# Altium project ESP32_C3_Breakout.PrjPcb
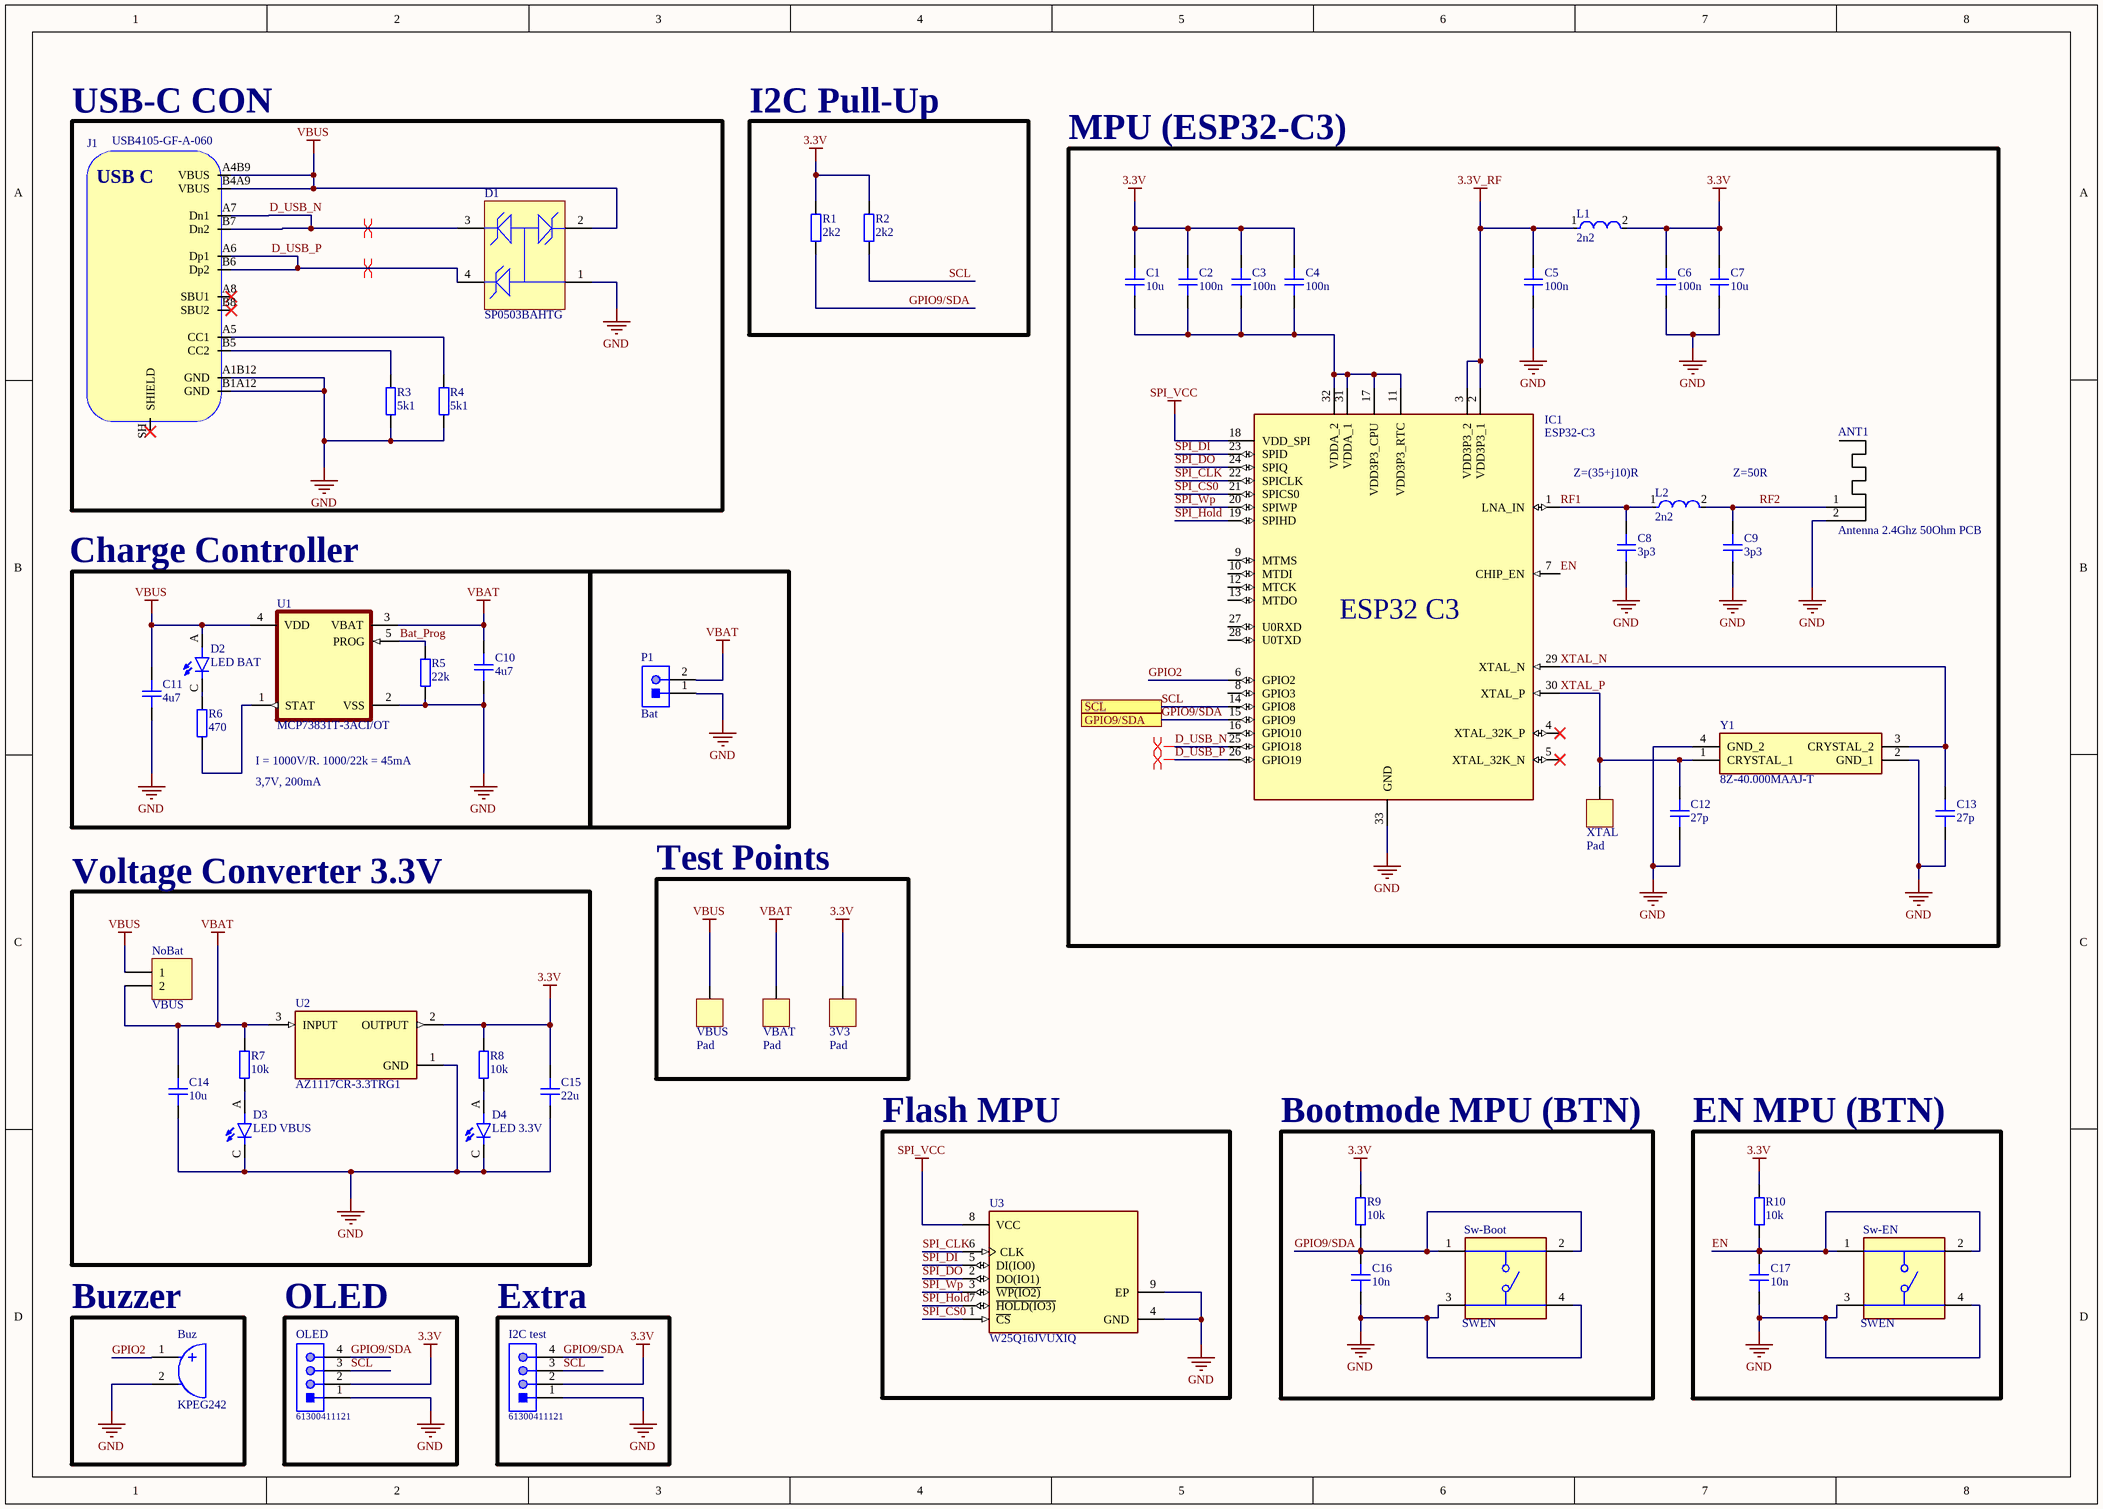
[diagram p0: IC_Schematic.SchDoc]
2 sheets, 77 parts. Net scope: flat (ports and power ports of the same name join across sheets).
Board file: ESP32_C3_Breakout.PcbDoc
Sheets:
  IC_Schematic.SchDoc
  Sensors.SchDoc

## Sheet IC_Schematic.SchDoc
size A3; SheetNumber: 1; SheetTotal: 2

### Parts
3V3  Pad  [PAD_SQ_2MM]
ANT1  Antenna 2.4Ghz 50Ohm PCB  [PCB_Antenna_2.4GHz_50Ohm]
Buz  KPEG242  [KINGS-KPEG242-2]
C1  10u  [CAP_1206]
C2  100n  [CAP_1206]
C3  100n  [CAP_1206]
C4  100n  [CAP_1206]
C5  100n  [CAP_1206]
C6  100n  [CAP_1206]
C7  10u  [CAP_1206]
C8  3p3  [CAP_1206]
C9  3p3  [CAP_1206]
C10  4u7  [CAP_1206]
C11  4u7  [CAP_1206]
C12  27p  [CAP_1206]
C13  27p  [CAP_1206]
C14  10u  [CAP_1206]
C15  22u  [CAP_1206]
C16  10n  [CAP_1206]
C17  10n  [CAP_1206]
D1  SP0503BAHTG  [LFUS-SOT143-4_V]
D2  LED BAT  [LED_1206]
D3  LED VBUS  [LED_1206]
D4  LED 3.3V  [LED_1206]
I2C_test  61300411121  [61300411121]
IC1  ESP32-C3  [QFN50P500X500X90-33N-D]
J1  USB4105-GF-A-060  [USB4105-GF-A-060]
L1  2n2  [FP-LQW18AN_10-MFG]
L2  2n2  [FP-LQW18AN_10-MFG]
NoBat  VBUS  [MHDR1X2]
OLED  61300411121  [61300411121]
P1  Bat  [JST-S2B-PH-K-S_V]
R1  2k2  [RES_1206]
R2  2k2  [RES_1206]
R3  5k1  [RES_1206]
R4  5k1  [RES_1206]
R5  22k  [RES_1206]
R6  470  [RES_1206]
R7  10k  [RES_1206]
R8  10k  [RES_1206]
R9  10k  [RES_1206]
R10  10k  [RES_1206]
Sw-Boot  SWEN  [Switch/Button 4 Pin Through Hole]
Sw-EN  SWEN  [Switch/Button 4 Pin Through Hole]
U1  MCP73831T-3ACI/OT  [SOT95P270X145-5N]
U2  AZ1117CR-3.3TRG1  [FP-SOT89-MFG]
U3  W25Q16JVUXIQ  [FP-UX-MFG]
VBAT  Pad  [PAD_SQ_2MM]
VBUS  Pad  [PAD_SQ_2MM]
XTAL  Pad  [PAD_SQ_2MM]
Y1  8Z-40.000MAAJ-T  [8Z40000MAAJT]

### Blocks framed on the sheet
USB-C CON: D1 J1 R3 R4
I2C Pull-Up: R1 R2
MPU (ESP32-C3): ANT1 C1-C9 C12 C13 IC1 L1 L2 XTAL Y1
Charge Controller: C10 C11 D2 R5 R6 U1
Test Points: 3V3 VBAT VBUS
Voltage Converter 3.3V: C14 C15 D3 D4 NoBat R7 R8 U2
Flash MPU: U3
Bootmode MPU (BTN): C16 R9 Sw-Boot
EN MPU (BTN): C17 R10 Sw-EN
Buzzer: Buz
OLED: OLED
Extra: I2C_test

### Ports
GPIO9/SDA (see Sensors[2D], Sensors[4A], Sensors[5C]), SCL (see Sensors[2C], Sensors[4A], Sensors[5C])

### Nets
3.3V: 3V3.1 C1.2 C2.2 C3.2 C4.2 C6.2 C7.2 C15.2 I2C_test.2 L1.2 OLED.2 R1.1 R2.1 R8.2 R9.1 R10.1 U2.2(OUTPUT)
3.3V_RF: C5.2 IC1.2(VDD3P3_1) IC1.3(VDD3P3_2) L1.1
GND: ANT1.2(GND) Buz.2 C5.1 C6.1 C7.1 C8.1 C9.1 C10.1 C11.1 C12.1 C13.1 C14.1 C15.1 C16.1 C17.1 D1.1 D3.C D4.C I2C_test.1 IC1.33(GND) J1.A1B12(GND) J1.B1A12(GND) OLED.1 P1.1 R3.1 R4.1 R5.1 Sw-Boot.3 Sw-Boot.4 Sw-EN.3 Sw-EN.4 U1.2(VSS) U2.1(GND) U3.4(GND) U3.9(EP) Y1.2(GND_1) Y1.4(GND_2)
SPI_VCC: IC1.18(VDD_SPI) U3.8(VCC)
VBAT: C10.2 C14.2 NoBat.2 P1.2 R7.2 U1.3(VBAT) U2.3(INPUT) VBAT.1
VBUS: C11.2 D1.2 D2.A J1.A4B9(VBUS) J1.B4A9(VBUS) NoBat.1 U1.4(VDD) VBUS.1
Bat_Prog: R5.2 U1.5(PROG)
D_USB_N: D1.3 IC1.25(GPIO18) J1.A7(Dn1) J1.B7(Dn2)
D_USB_P: D1.4 IC1.26(GPIO19) J1.A6(Dp1) J1.B6(Dp2)
EN: C17.2 IC1.7(CHIP_EN) R10.2 Sw-EN.1 Sw-EN.2
GPIO2: Buz.1 IC1.6(GPIO2)
GPIO9/SDA: C16.2 I2C_test.4 IC1.15(GPIO9) OLED.4 R1.2 R9.2 Sw-Boot.1 Sw-Boot.2 ; port GPIO9/SDA
RF1: C8.2 IC1.1(LNA_IN) L2.1
RF2: ANT1.1(RF) C9.2 L2.2
SCL: I2C_test.3 IC1.14(GPIO8) OLED.3 R2.2 ; port SCL
SPI_CLK: IC1.22(SPICLK) U3.6(CLK)
SPI_CS0: IC1.21(SPICS0) U3.1(~{CS})
SPI_DI: IC1.23(SPID) U3.5(DI(IO0))
SPI_DO: IC1.24(SPIQ) U3.2(DO(IO1))
SPI_Hold: IC1.19(SPIHD) U3.7(~{HOLD(IO3)})
SPI_Wp: IC1.20(SPIWP) U3.3(~{WP(IO2)})
XTAL_N: C13.2 IC1.29(XTAL_N) Y1.3(CRYSTAL_2)
XTAL_P: C12.2 IC1.30(XTAL_P) XTAL.1 Y1.1(CRYSTAL_1)
NetC1_1: C1.1 C2.1 C3.1 C4.1 IC1.11(VDD3P3_RTC) IC1.17(VDD3P3_CPU) IC1.31(VDDA_1) IC1.32(VDDA_2)
NetD2_C: D2.C R6.2
NetD3_A: D3.A R7.1
NetD4_A: D4.A R8.1
NetJ1_A5: J1.A5(CC1) R4.2
NetJ1_B5: J1.B5(CC2) R3.2
NetR6_1: R6.1 U1.1(STAT)

Not connected (* = marked no-connect by the designer): IC1 4(XTAL_32K_P)* 5(XTAL_32K_N)* 8(GPIO3) 9(MTMS) 10(MTDI) 12(MTCK) 13(MTDO) 16(GPIO10) 27(U0RXD) 28(U0TXD); J1 A8(SBU1)* B8(SBU2)* SH(SHIELD)*

### Layout directives
differential pair: D_USB_N, D_USB_P

### Notes on the sheet
- Z=(35+j10)R
- Z=50R
- I = 1000V/R. 1000/22k = 45mA
- 3,7V, 200mA
- (in symbol ESP32-C3) ESP32 C3
- (in symbol USB4105-GF-A-060) USB C

### Library data of the parts
3V3 VBAT VBUS XTAL = PAD_SQ_2MM: Test Point Square 2mm
ANT1 = Antenna 2.4Ghz 50Ohm PCB: ESP32 C3
Buz = CMP-2000-06518-1: Piezo Indicator, 4100 Hz, 3 to 16 V, -20 to 70 degC, 2-Pin THD, RoHS; PartNumber: KPE-242; Manufacturer: KingstateElectronicsCorp.; Frequency Range: 3600to4600Hz; Maximum Supply Current: 7mA; Typical Operating Supply Voltage: 12Vdc; Product Height: 7.6mm; Current - Max: 7A; Tone Mode: Continuous; Product Diameter: 13.7mm; Minimum Sound Pressure: 70dBA; Maximum Resonant Frequency: 4600Hz; Type: Indicator; Datasheet URL: https://datasheet.ciiva.com/11776/0900766b8068f3a2-11776713.pdf; Mounting: ThroughHole; Technology: Piezo; Operating Temperature: -20to70°C; Category: AudioIndicatorsandAlerts; Termination Method: Pin; Manufacturer URL: http://www.kingstate.com.tw/index.php/en/; Package Description: 2-Pin Through Hole Device, Body Dia 13.7 mm, Pitch 7.62 mm; Datasheet Version: 01/2006; Package Reference: KPEG242; Mounting Technology: ThroughHole
C1-C17 = CAP_1206_50V: Capacitor SMD 1206 50V
D1 = CMP-2000-05191-1: TVS Diode Array, 30 pF, 30 KV, -40 to 85 degC, 4-Pin SOT143, RoHS, Tape and Reel; Manufacturer: Littelfuse; Direction Type: Uni-Directional; Product Height (mm): 1.05mm; Leakage Current (Max): 0.1uA; Clamping Voltage (Max): 8V; Reverse Stand-off Voltage: 5.5(Min)V; Configuration: Triple; Working Voltage: 5.5V; Product Length (mm): 3.04mm; Working Voltage (Max): 5.5V(Min); Capacitance Value: 30pF; Rad Hardened: No; Number of Elements: 3; Product Depth (mm): 1.4mm; Operating Temperature Max Deg. C: 85C; Suppressor Type: TVS; Operating Temperature Min Deg. C: -40C; Operating Temp Range: -40Cto85C; Mounting: SurfaceMount; Package / Case: SOT-143; Datasheet Version: Dec-13; Package Type: SOT-143; Packaging: TapeandReel; Pin Count: 3+Tab; Operating Temperature Classification: Industrial; Datasheet URL: https://datasheet.ciiva.com/15143/getdatasheetpartid-116020-15143550.pdf; Manufacturer URL: http://www.littelfuse.com/; Leakage Current: 0.1uA; Mounting Style: SurfaceMount; Clamping Voltage: 8V; Polarity: Uni-Directional
D2-D4 = LED - 1206: Yellow 587nm LED Indication - Discrete 2V 1206 _3216 Metric_; MF: Lite-On Inc.; MP: LTST-C230KSKT; Value: *; SnapEDA_Link: https://www.snapeda.com/parts/LTST-C230KSKT/Lite-On%20Inc./view-part/264912/?ref=snap; Availability: Unavailable; Package: 1206 Lite-On; Price: None
I2C_test OLED = CMP-1502-01064-1: THT Vertical Pin Header WR-PHD, Pitch 2.54 mm, Single Row, 4 pins; Manufacturer: Wurth Elektronik; Withstanding Voltage: 500VAC; Rated Current: 3A; Working Voltage: 250VAC; Pin Number: 4; Gender: Male; Contact Resistance: 20mOhm; Pitch: 2.54mm; Manufacturer URL: http://www.we-online.de; Operating Temperature: -40to105degC; Packaging: Bag; Mounting Technology: THT; Package Reference: 61300411121; Datasheet URL: https://katalog.we-online.de/em/datasheet/6130xx11121.pdf; Publisher: WurthElektronik; Part Number: 61300411121; Row Number: Single; Orientation: Vertical
IC1 = ESP32-C3: Integrated Circuit; Manufacturer_Name: Espressif Systems; Datasheet Link: https://www.espressif.com/sites/default/files/documentation/esp32-c3_datasheet_en.pdf; Height: 0.9mm; Manufacturer_Part_Number: ESP32-C3; Mouser Part Number: 356-ESP32-C3; Mouser Price/Stock: https://www.mouser.co.uk/ProductDetail/Espressif-Systems/ESP32-C3?qs=iLbezkQI%252BsiMXe7tMG%252Bo%2FA%3D%3D
J1 = USB4105-GF-A-060: USB Connector Type C SMT 12 Pin; Manufacturer: GCT; Manufacturer Part Number: USB4105-GF-A-060
L1 L2 = CMP-06042-001078-1: Wire Wound RF Inductor for Automotive 2.2nH ±0.5nH 1400mA 0.018Ω 0603 (1608)
NoBat = MHDR1X2: Header, 2-Pin; LatestRevisionDate: 17-Jul-2002; LatestRevisionNote: Re-released for DXP Platform.; Publisher: Altium Limited
P1 = CMP-1755-00004-1: Male Header, Pitch 2 mm, 1 x 2 Position, Height 4.8 mm, Tail Length 3.4 mm, -25 to 85 degC, RoHS, Bulk; Case\Package: Radial; Tolerance: 20%; Capacitance: 10 uF; Voltage Rating (DC): 50 V; Packaging: Bulk; ComponentLink1URL: http://www.jst-mfg.com/product/pdf/eng/ePH.pdf; Radiation Hardening: No; Height: 11 mm; Package Quantity: 200; PackageDescription: Male Header, Pitch 2 mm, 1 x 2 Position, Height 4.8 mm, Tail Length 3.4 mm; PackageReference: S2B-PH-K-S; Diameter: 5 mm; Pins: 2; Mount: Through Hole; Max Operating Temperature: 85 degC; Min Operating Temperature: -40 degC; ComponentLink1Description: Datasheet; DatasheetVersion: Dec-12; Length: 11 mm; Lead Pitch: 2 mm; REACH SVHC: No SVHC; Voltage Rating: 50 V; RoHSCompliant: true
R1-R10 = RES_1206: Resistor SMD 1206
Sw-Boot Sw-EN = Switch/Button 4 Pin Through Hole: TS02-66-120-BK-260-LCR-D / 6 x 6 mm, 12 mm Actuator Height, 260 gf, Black, Long Crimped, Through Hole, SPST, Tactile Switch; MF: CUI Devices; SnapEDA_Link: https://www.snapeda.com/parts/TS02-66-120-BK-260-LCR-D/CUI+Devices/view-part/?ref=snap; Package: None; MP: TS02-66-120-BK-260-LCR-D; CUI_purchase_URL: https://www.cuidevices.com/product/switches/tactile-switches/ts02-series?utm_source=snapeda.com&utm_medium=referral&utm_campaign=snapedaBOM; Value: *; Check_prices: https://www.snapeda.com/parts/TS02-66-120-BK-260-LCR-D/CUI+Devices/view-part/?ref=eda; Price: None; Purchase-URL: https://pricing.snapeda.com/search/part/TS02-66-120-BK-260-LCR-D/?ref=eda; Availability: In Stock
U1 = MCP73831T-3ACI/OT: Charger IC Lithium Ion/Polymer SOT-23-5; MF: Microchip; Package: SOT-23-5 Microchip; MP: MCP73831T-3ACI/OT; SnapEDA_Link: https://www.snapeda.com/parts/MCP73831T-3ACI/OT/Microchip/view-part/1099789/?ref=snap; Mouser-Purchase-URL: https://snapeda.com/shop?store=Mouser&id=1099789; Value: *; Arrow_Electronics-Purchase-URL: https://snapeda.com/shop?store=Arrow+Electronics&id=1099789
U2 = CMP-12756-000007-1: IC REG LINEAR 3.3V 800MA SOT89; Manufacturer: Diodes Inc.; Nominal Supply Current: 4mA; Output Type: Fixed; Accuracy Percentage: 1%; Max Junction Temp: +125°C; Max Supply Voltage: 15V; Number Of Outputs: 1; Output Current: 1.35A; Dropout Voltage: 1.2V; Device Class L1: Integrated Circuits (ICs); ComponentLink2URL: https://www.diodes.com/assets/Datasheets/AZ1117C.pdf; Temperature Range High: +125°C; Octopart: https://octopart.com/az1117cr-3.3trg1-diodes+inc.-30954805; Output Voltage: 3.3V; Automotive: No; RoHS: TRUE; Temperature Range Low: -20°C; Package: SOT89; Height: 1.6mm; Mouser Description: DiodesZetex AZ1117CR-3.3TRG1, LDO Regulator, 800mA, 3.3 V, ±1% 3-Pin, SOT-89; Manufacturer Part Number: AZ1117CR-3.3TRG1; ComponentLink2Description: Datasheet; Device Class L2: Power Management ICs; Lead Free: Yes; Device Class L3: Voltage Regulators - Linear; Category: IC; Temperature: -20°C to +125°C; Footprint Url: https://www.diodes.com/assets/Package-Files/SOT89.pdf; Digikey Description: IC REG LINEAR 3.3V 800MA SOT89
U3 = CMP-78876-000011-1: IC FLASH 16MBIT SPI/QUAD 8USON; RoHS Compliant: Yes
Y1 = 8Z-40.000MAAJ-T: Crystal or Oscillator; Manufacturer_Name: TXC CORPORATION; Datasheet Link: https://www.farnell.com/datasheets/1041872.pdf; Height: 0.55mm; Manufacturer_Part_Number: 8Z-40.000MAAJ-T; Arrow Part Number: 8Z-40.000MAAJ-T; Arrow Price/Stock: https://www.arrow.com/en/products/8z-40.000maaj-t/txc-corporation

## Sheet Sensors.SchDoc
size A3; SheetNumber: 2; SheetTotal: 2
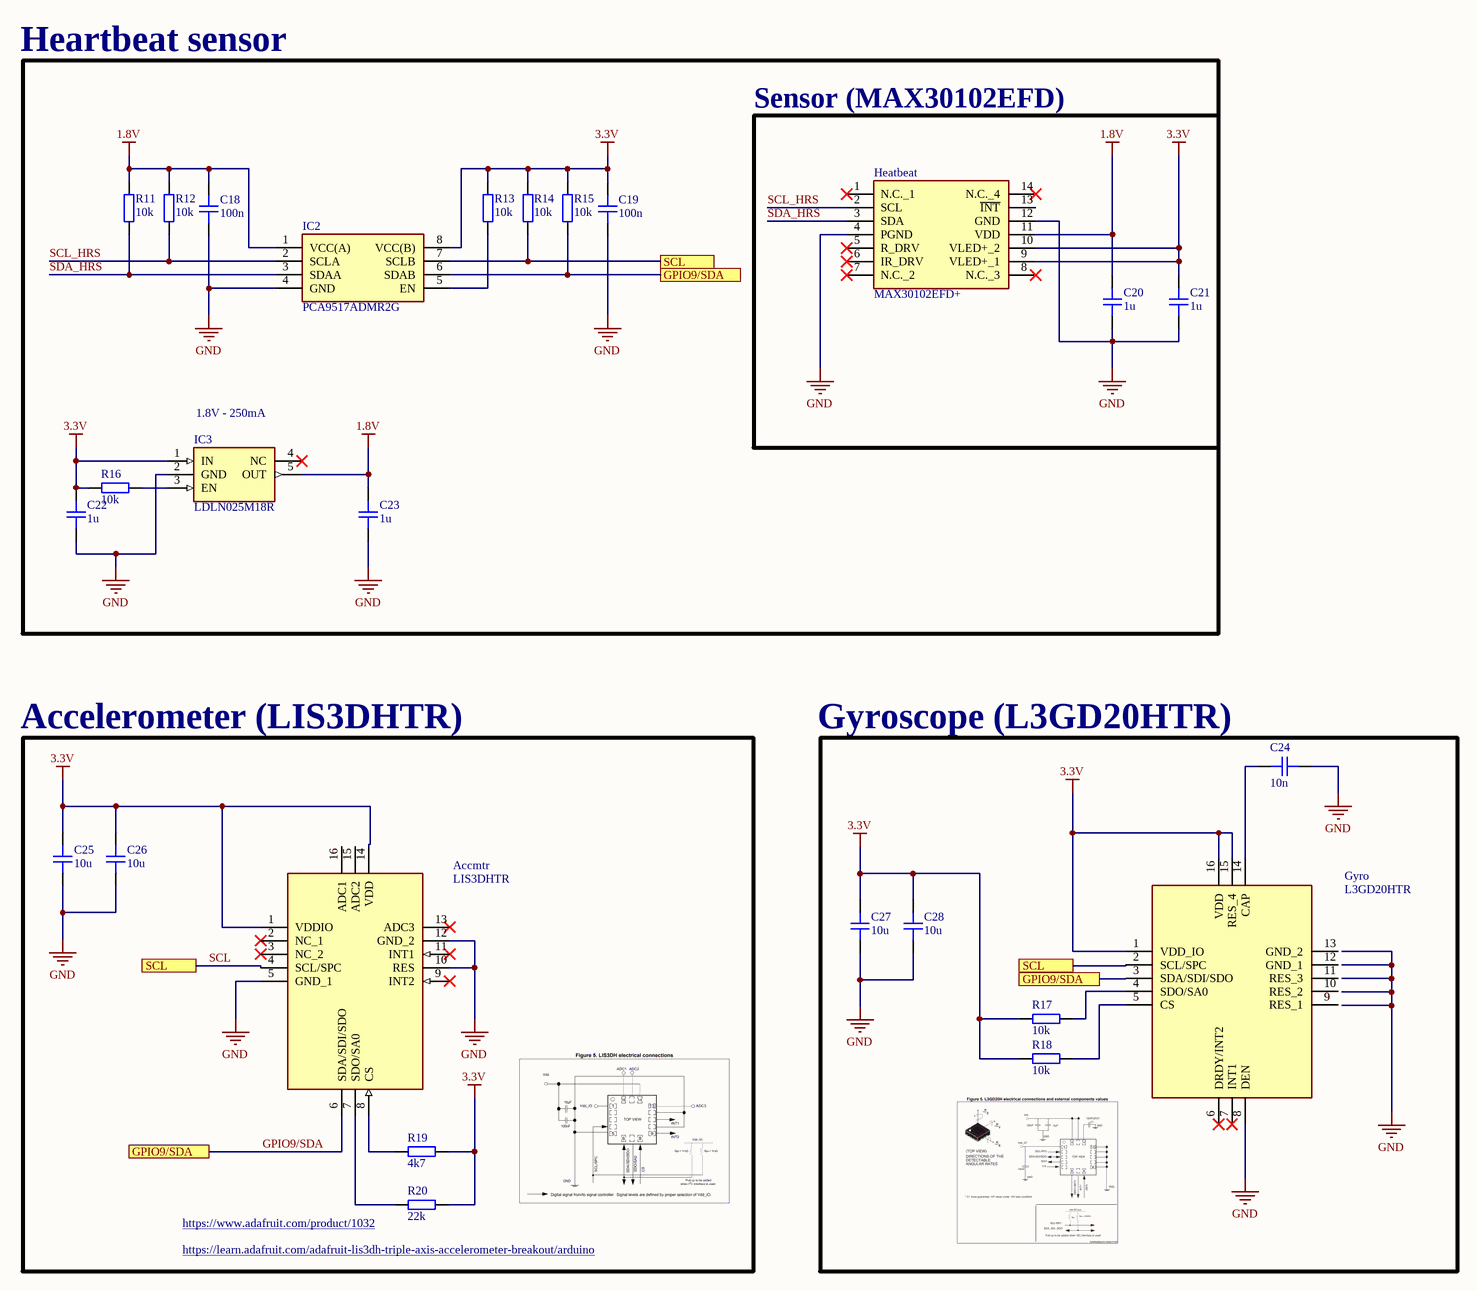
[diagram p1: Sensors.SchDoc]

### Parts
Accmtr  LIS3DHTR  [LIS3DHTR]
C18  100n  [CAP_1206]
C19  100n  [CAP_1206]
C20  1u  [CAP_1206]
C21  1u  [CAP_1206]
C22  1u  [CAP_1206]
C23  1u  [CAP_1206]
C24  10n  [CAP_1206]
C25  10u  [CAP_1206]
C26  10u  [CAP_1206]
C27  10u  [CAP_1206]
C28  10u  [CAP_1206]
Gyro  L3GD20HTR  [H3LIS100DLTR]
Heatbeat  MAX30102EFD+  [14-LEAD-OESIP]
IC2  PCA9517ADMR2G  [SOP65P490X110-8N]
IC3  LDLN025M18R  [SOT95P280X145-5N]
R11  10k  [RES_1206]
R12  10k  [RES_1206]
R13  10k  [RES_1206]
R14  10k  [RES_1206]
R15  10k  [RES_1206]
R16  10k  [RES_1206]
R17  10k  [RES_1206]
R18  10k  [RES_1206]
R19  4k7  [RES_1206]
R20  22k  [RES_1206]

### Blocks framed on the sheet
Heartbeat sensor: C18 C19 C22 C23 IC2 IC3 R11-R16
Sensor (MAX30102EFD): C20 C21 Heatbeat
Accelerometer (LIS3DHTR): Accmtr C25 C26 R19 R20
Gyroscope (L3GD20HTR): C24 C27 C28 Gyro R17 R18

### Ports
GPIO9/SDA (see IC_Schematic[5B], Sensors[2D], Sensors[4A]), GPIO9/SDA (see IC_Schematic[5B], Sensors[2D], Sensors[5C]), GPIO9/SDA (see IC_Schematic[5B], Sensors[4A], Sensors[5C]), SCL (see IC_Schematic[5B], Sensors[2C], Sensors[4A]), SCL (see IC_Schematic[5B], Sensors[2C], Sensors[5C]), SCL (see IC_Schematic[5B], Sensors[4A], Sensors[5C])

### Nets
1.8V: C18.2 C20.2 C23.2 Heatbeat.11(VDD) IC2.1(VCC(A)) IC3.5(OUT) R11.1 R12.1
3.3V: Accmtr.1(VDDIO) Accmtr.14(VDD) C19.2 C21.2 C22.2 C25.2 C26.2 C27.2 C28.2 Gyro.1(VDD_IO) Gyro.15(RES_4) Gyro.16(VDD) Heatbeat.9(VLED+_1) Heatbeat.10(VLED+_2) IC2.8(VCC(B)) IC3.1(IN) R13.1 R14.1 R15.1 R16.1 R17.2 R18.2 R19.1 R20.1
GND: Accmtr.5(GND_1) Accmtr.10(RES) Accmtr.12(GND_2) C18.1 C19.1 C20.1 C21.1 C22.1 C23.1 C24.2 C25.1 C26.1 C27.1 C28.1 Gyro.8(DEN) Heatbeat.4(PGND) Heatbeat.12(GND) IC2.4(GND) IC3.2(GND)
GPIO9/SDA: Accmtr.6(SDA/SDI/SDO) Gyro.3(SDA/SDI/SDO) IC2.6(SDAB) R15.2 ; port GPIO9/SDA
SCL: Accmtr.4(SCL/SPC) Gyro.2(SCL/SPC) IC2.7(SCLB) R14.2 ; port SCL
SCL_HRS: Heatbeat.2(SCL) IC2.2(SCLA) R12.2
SDA_HRS: Heatbeat.3(SDA) IC2.3(SDAA) R11.2
NetAccmtr_7: Accmtr.7(SDO/SA0) R20.2
NetAccmtr_8: Accmtr.8(CS) R19.2
NetC24_1: C24.1 Gyro.14(CAP)
NetGyro_4: Gyro.4(SDO/SA0) R17.1
NetGyro_5: Gyro.5(CS) R18.1
NetIC2_5: IC2.5(EN) R13.2
NetIC3_3: IC3.3(EN) R16.2

Not connected (* = marked no-connect by the designer): Accmtr 2(NC_1)* 3(NC_2)* 9(INT2)* 11(INT1)* 13(ADC3)* 15(ADC2) 16(ADC1); Gyro 6(DRDY/INT2)* 7(INT1)* 9(RES_1) 10(RES_2) 11(RES_3) 12(GND_1) 13(GND_2); Heatbeat 1(N.C._1)* 5(R_DRV)* 6(IR_DRV)* 7(N.C._2)* 8(N.C._3)* 13(~{INT}) 14(N.C._4)*; IC3 4(NC)*

### Notes on the sheet
- (near IC3) 1.8V - 250mA
- (near R20) https://www.adafruit.com/product/1032
- (near R20) https://learn.adafruit.com/adafruit-lis3dh-triple-axis-accelerometer-breakout/arduino

### Library data of the parts
Accmtr = LIS3DHTR: Accelerometer; Manufacturer_Name: STMicroelectronics; Datasheet Link: http://www.st.com/content/ccc/resource/technical/document/datasheet/3c/ae/50/85/d6/b1/46/fe/CD00274221.pdf/files/CD00274221.pdf/jcr:content/translations/en.CD00274221.pdf; Height: 1mm; Manufacturer_Part_Number: LIS3DHTR; Mouser Part Number: 511-LIS3DHTR; Mouser Price/Stock: https://www.mouser.co.uk/ProductDetail/STMicroelectronics/LIS3DHTR?qs=6la6oa3D8xzhXYax3cEo4w%3D%3D; Arrow Part Number: LIS3DHTR; Arrow Price/Stock: https://www.arrow.com/en/products/lis3dhtr/stmicroelectronics
C18-C23 = CAP_1206_16V: Capacitor SMD 1206 16V
C24-C28 = CAP_1206_50V: Capacitor SMD 1206 50V
Gyro = L3GD20HTR: MEMS motion sensor: / three-axis digital output gyroscope; Manufacturer_Name: STMicroelectronics; Datasheet Link: http://www.st.com/content/ccc/resource/technical/document/datasheet/35/b1/e0/39/71/57/43/01/DM00060659.pdf/files/DM00060659.pdf/jcr:content/translations/en.DM00060659.pdf; Height: 1mm; Manufacturer_Part_Number: L3GD20HTR; Mouser Part Number: 511-L3GD20HTR; Mouser Price/Stock: https://www.mouser.co.uk/ProductDetail/STMicroelectronics/L3GD20HTR?qs=7v3IMFVTeKNoM%2F2Sb4QSlQ%3D%3D; Arrow Part Number: L3GD20HTR; Arrow Price/Stock: https://www.arrow.com/en/products/l3gd20htr/stmicroelectronics
Heatbeat = MAX30102EFD+: Integrated Circuit; Manufacturer_Name: Analog Devices; Datasheet Link: https://datasheets.maximintegrated.com/en/ds/MAX30102.pdf; Manufacturer_Part_Number: MAX30102EFD+; Mouser Part Number: 700-MAX30102EFD+; Mouser Price/Stock: https://www.mouser.co.uk/ProductDetail/Maxim-Integrated/MAX30102EFD%2b?qs=nVS1qgv%252BQrk9UYEvS27V%2Fg%3D%3D
IC2 = PCA9517ADMR2G: Integrated Circuit; Manufacturer_Name: onsemi; Datasheet Link: https://www.arrow.com/en/products/pca9517admr2g/on-semiconductor; Height: 1.1mm; Manufacturer_Part_Number: PCA9517ADMR2G; Mouser Part Number: 863-PCA9517ADMR2G; Mouser Price/Stock: https://www.mouser.co.uk/ProductDetail/onsemi/PCA9517ADMR2G?qs=tCMd4XlZ%2FiBws0nQ3cmpKw%3D%3D; Arrow Part Number: PCA9517ADMR2G; Arrow Price/Stock: https://www.arrow.com/en/products/pca9517admr2g/on-semiconductor?region=nac
IC3 = LDLN025M18R: Integrated Circuit; Manufacturer_Name: STMicroelectronics; Datasheet Link: https://mouser.componentsearchengine.com/Datasheets/2/LDLN025M18R.pdf; Height: 1.45mm; Manufacturer_Part_Number: LDLN025M18R; Mouser Part Number: 511-LDLN025M18R; Mouser Price/Stock: https://www.mouser.co.uk/ProductDetail/STMicroelectronics/LDLN025M18R?qs=5aG0NVq1C4xLjfzI8y7cFQ%3D%3D; Arrow Part Number: LDLN025M18R; Arrow Price/Stock: https://www.arrow.com/en/products/ldln025m18r/stmicroelectronics
R11-R20 = RES_1206: Resistor SMD 1206

## Nets that join several sheets
3.3V: IC_Schematic (17 pins), Sensors (24 pins)
GND: IC_Schematic (37 pins), Sensors (19 pins)
GPIO9/SDA: IC_Schematic (8 pins), Sensors (Accmtr.6 Gyro.3 IC2.6 R15.2)
SCL: IC_Schematic (I2C_test.3 IC1.14 OLED.3 R2.2), Sensors (Accmtr.4 Gyro.2 IC2.7 R14.2)